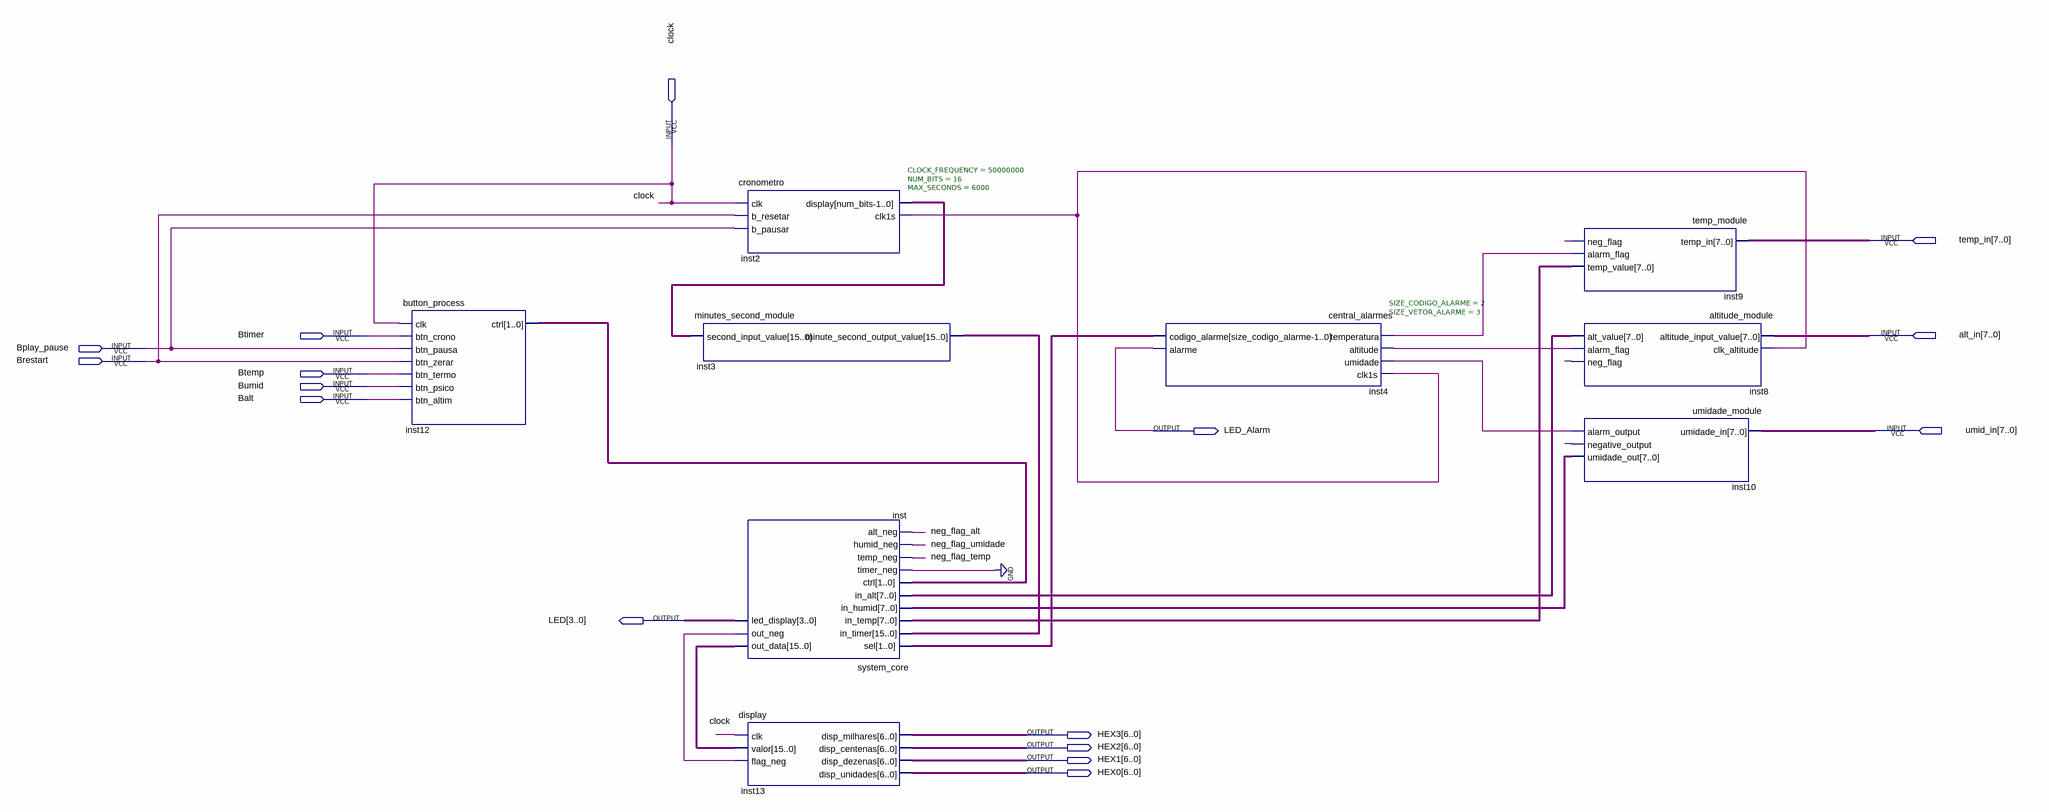
[diagram p0: schematic sheet]
// Quartus schematic main.bdf as structural Verilog: 9 symbols, 16 pins
module main (
  input  clock,
  input  [7:0] temp_in,
  input  Btimer,
  input  [7:0] alt_in,
  input  Bplay_pause,
  input  Brestart,
  input  Btemp,
  input  Bumid,
  input  Balt,
  input  [7:0] umid_in,
  output LED_Alarm,
  output [3:0] LED,
  output [6:0] HEX3,
  output [6:0] HEX2,
  output [6:0] HEX1,
  output [6:0] HEX0
);

  wire inst2_clk1s, inst8_alarm_flag, inst9_alarm_flag, inst10_alarm_output, inst_out_neg, neg_flag_alt,
       neg_flag_temp, neg_flag_umidade;
  wire [1:0] inst4_codigo_alarme, inst12_ctrl;
  wire [7:0] inst8_alt_value, inst9_temp_value, inst10_umidade_out;
  wire [15:0] inst2_display, inst3_minute_second_output_value, inst_out_data;

  button_process inst12 (
    .clk(clock), .btn_crono(Btimer), .btn_pausa(Bplay_pause), .btn_zerar(Brestart), .btn_termo(Btemp),
    .btn_psico(Bumid), .btn_altim(Balt), .ctrl(inst12_ctrl));
  minutes_second_module inst3 (
    .second_input_value(inst2_display), .minute_second_output_value(inst3_minute_second_output_value));
  cronometro #(.CLOCK_FREQUENCY(50000000), .NUM_BITS(16), .MAX_SECONDS(6000)) inst2 (
    .clk(clock), .b_resetar(Brestart), .b_pausar(Bplay_pause), .display(inst2_display), .clk1s(inst2_clk1s));
  system_core inst (
    .sel(inst4_codigo_alarme), .in_timer(inst3_minute_second_output_value), .in_temp(inst9_temp_value),
    .in_humid(inst10_umidade_out), .in_alt(inst8_alt_value), .ctrl(inst12_ctrl), .timer_neg(1'b0),
    .temp_neg(neg_flag_temp), .humid_neg(neg_flag_umidade), .alt_neg(neg_flag_alt), .out_data(inst_out_data),
    .out_neg(inst_out_neg), .led_display(LED));
  display inst13 (
    .clk(clock), .valor(inst_out_data), .flag_neg(inst_out_neg), .disp_milhares(HEX3), .disp_centenas(HEX2),
    .disp_dezenas(HEX1), .disp_unidades(HEX0));
  central_alarmes #(.SIZE_CODIGO_ALARME(2), .SIZE_VETOR_ALARME(3)) inst4 (
    .temperatura(inst9_alarm_flag), .altitude(inst8_alarm_flag), .umidade(inst10_alarm_output),
    .clk1s(inst2_clk1s), .codigo_alarme(inst4_codigo_alarme), .alarme(LED_Alarm));
  temp_module inst9 (
    .temp_in(temp_in), .neg_flag(neg_flag_temp), .alarm_flag(inst9_alarm_flag), .temp_value(inst9_temp_value));
  altitude_module inst8 (
    .altitude_input_value(alt_in), .clk_altitude(inst2_clk1s), .alt_value(inst8_alt_value),
    .alarm_flag(inst8_alarm_flag), .neg_flag(neg_flag_alt));
  umidade_module inst10 (
    .umidade_in(umid_in), .alarm_output(inst10_alarm_output), .negative_output(neg_flag_umidade),
    .umidade_out(inst10_umidade_out));
endmodule
